# EAGLE design adapter (EAGLE 9.6.2)
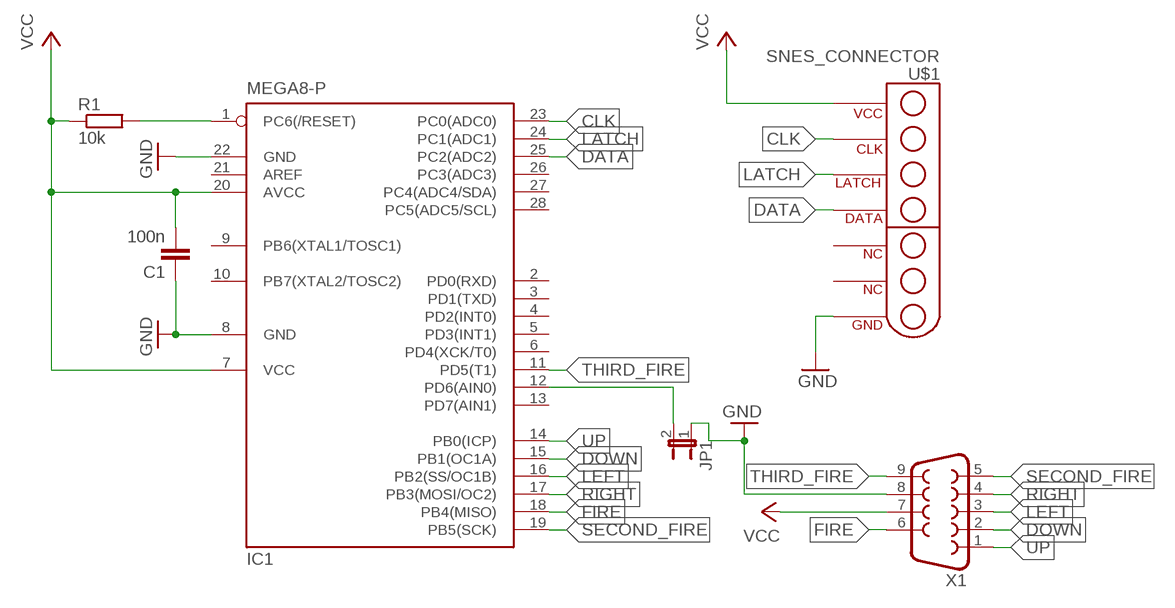
[diagram p0: schematic, sheet 1]

## Parts
C1  100n  C-EU025-025X050  [C025-025X050]
IC1  MEGA8-P  [DIL28-3]
JP1  JP1E  [JP1]
R1  10k  R-EU_0207/10  [0207/10]
U$1  SNES_CONNECTOR  [SNES_CONNECTOR]
X1  F09D  [F09D]

## Nets
CLK: IC1.23(PC0(ADC0)) U$1.P$9(CLK)
DATA: IC1.25(PC2(ADC2)) U$1.P$11(DATA)
DOWN: IC1.15(PB1(OC1A)) X1.2
FIRE: IC1.18(PB4(MISO)) X1.6
GND: C1.1 IC1.8(GND) IC1.22(GND) JP1.1 U$1.P$14(GND) X1.8
LATCH: IC1.24(PC1(ADC1)) U$1.P$10(LATCH)
LEFT: IC1.16(PB2(SS/OC1B)) X1.3
N$1: IC1.12(PD6(AIN0)) JP1.2
N$2: IC1.1(PC6(/RESET)) R1.2
RIGHT: IC1.17(PB3(MOSI/OC2)) X1.4
SECOND_FIRE: IC1.19(PB5(SCK)) X1.5
THIRD_FIRE: IC1.11(PD5(T1)) X1.9
UP: IC1.14(PB0(ICP)) X1.1
VCC [bold]: C1.2 IC1.7(VCC) IC1.20(AVCC) R1.1 U$1.P$8(VCC) X1.7
Unconnected: IC1.2(PD0(RXD)) IC1.3(PD1(TXD)) IC1.4(PD2(INT0)) IC1.5(PD3(INT1)) IC1.6(PD4(XCK/T0)) IC1.9(PB6(XTAL1/TOSC1)) IC1.10(PB7(XTAL2/TOSC2)) IC1.13(PD7(AIN1)) IC1.21(AREF) IC1.26(PC3(ADC3)) IC1.27(PC4(ADC4/SDA)) IC1.28(PC5(ADC5/SCL)) U$1.P$12(NC1) U$1.P$13(NC2)

## Library data of the parts
C1 = rcl:C-EU: CAPACITOR, European symbol; SPICEPREFIX: C
IC1 = atmel:MEGA8-P: MICROCONTROLLER 8 Kbytes FLASH, 1 kbytes SRAM, 512 bytes EEPROM, USART, 4-channel 10 bit ADC, 2-channel 8 bit ADC Pin compatible with Atmega48, ATMega88, ATMega168 Source: avr.lbr; OC_FARNELL: unknown; OC_NEWARK: unknown
JP1 = jumper:JP1E: JUMPER
R1 = rcl:R-EU_: RESISTOR, European symbol; SPICEPREFIX: R
U$1 = uzebox:SNES_CONNECTOR: Generic SNES connector
X1 = con-subd:F09: SUB-D; OC_FARNELL: unknown; OC_NEWARK: unknown

## Net classes
1 bold: width 0.508 mm

## Board
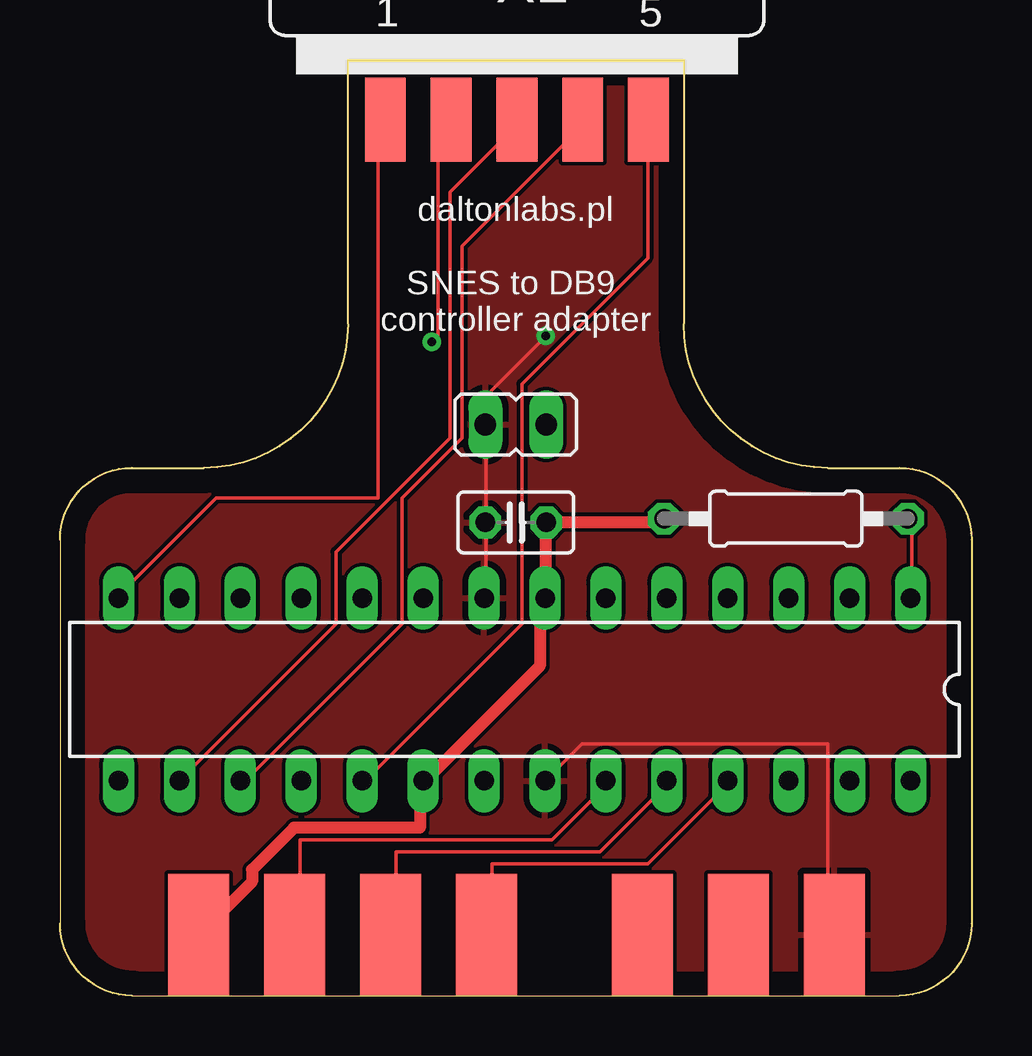
[diagram p1: board, top side]
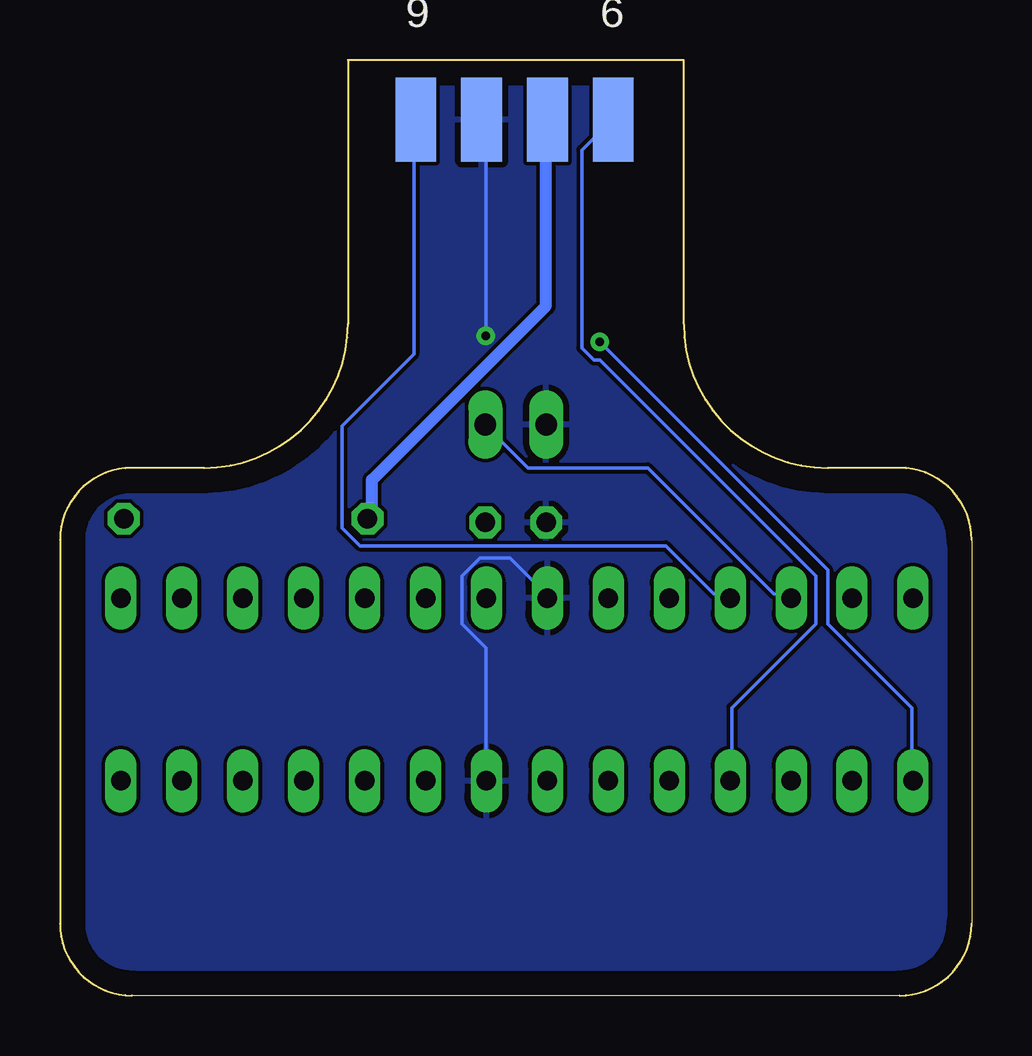
[diagram p2: board, bottom side, seen from below]

Size 38 x 39 mm. Coordinates in mm from the lower left corner, seen from the top.
Outline: 3,0 35,0 arc90 38,3 38,19 arc90 35,22 32,22 arc-90 26,28 26,39 12,39 12,28 arc-90 6,22 3,22 arc90 0,19 0,3 arc90 3,0
Copper layers (1*16): Top 0.035mm / dielectric 1.5mm / Bottom 0.035mm
Design rules "default": minimum track width 6mil, minimum drill 0.35mm, track to track 6mil, track to pad 6mil, pad to pad 6mil, via to via 6mil, smd to smd 6mil, copper to edge 40mil, drill to drill 6mil, minimum pad ring 10mil, minimum via ring 8mil, stop-mask expansion 4mil, vias tented up to drill 0mil, thermal gap 10mil

### Footprints (pad centres in the part's own frame; a part is rotated, then mirrored left to right if it is on the bottom)
C025-025X050 = drill 0.813 octagon: 1 -1.27,0; 2 1.27,0
DIL28-3 = drill 0.813 long: 1 -16.51,-3.81; 2 -13.97,-3.81; 3 -11.43,-3.81; 4 -8.89,-3.81; 5 -6.35,-3.81; 6 -3.81,-3.81; 7 -1.27,-3.81; 8 1.27,-3.81; 9 3.81,-3.81; 10 6.35,-3.81; 11 8.89,-3.81; 12 11.43,-3.81; 13 13.97,-3.81; 14 16.51,-3.81; 15 16.51,3.81; 16 13.97,3.81; 17 11.43,3.81; 18 8.89,3.81; 19 6.35,3.81; 20 3.81,3.81; 21 1.27,3.81; 22 -1.27,3.81; 23 -3.81,3.81; 24 -6.35,3.81; 25 -8.89,3.81; 26 -11.43,3.81; 27 -13.97,3.81; 28 -16.51,3.81
JP1 = drill 0.914 long: 1 0,-1.27; 2 0,1.27
0207/10 = drill 0.813 octagon: 1 -5.08,0; 2 5.08,0
SNES_CONNECTOR = smd 2.54 x 5.08: P$8 -12,2.54; P$9 -8,2.54; P$10 -4,2.54; P$11 0,2.54; P$12 6.5,2.54; P$13 10.5,2.54; P$14 14.5,2.54
F09D = smd 1.7 x 3.5: 1 -5.486,-6.045; 2 -2.743,-6.045; 3 0,-6.045; 4 2.743,-6.045; 5 5.486,-6.045 | smd 1.7 x 3.5 bottom: 6 -4.115,-6.045; 7 -1.372,-6.045; 8 1.372,-6.045; 9 4.115,-6.045

### Placement (x,y rotation side)
C1  19,19.72 0 top
IC1  18.95,12.76 180 top
JP1  19,23.8 270 top
R1  30.26,19.88 0 top
U$1  17.78,0 0 top
X1  19.05,42.56 0 top

### Tracks (layer width: path | path; a pad name or v marks a point on that pad's centre or on a via)
CLK
  Top 0.152: IC1.23 22.75,8.75 20.5,6.5 10,6.5 10,2.75 U$1.P$9
DATA
  Top 0.152: IC1.25 27.75,8.75 24.5,5.5 18,5.5 18,2.75 U$1.P$11
DOWN  (via drill 0.35)
  Top 0.152: v15.5,27.25 15.75,27.5 15.75,36 16.25,36.5 X1.2
  Bottom 0.152: v15.5,27.25 6,17.75 6,15.5 2.5,12 2.5,9 IC1.15
FIRE
  Bottom 0.152: IC1.18 10,9 10,12 6.5,15.5 6.5,17.5 15.5,26.5 15.75,26.5 16.25,27 16.25,35.25 15,36.5 X1.6
GND  (via drill 0.35)
  Top 0.152: IC1.22 20.25,9 21.75,10.5 32,10.5 32,3 32.25,2.75 U$1.P$14 | IC1.8 17.75,16.75 17.75,19.5 C1.1 17.75,19.75 17.75,23.75 JP1.1 17.75,24 17.75,25 v20.25,27.5
  Bottom 0.152: v20.25,27.5 20.25,36.5 X1.8 | IC1.22 20.25,9 20.25,14.5 21.25,15.5 21.25,17.5 20.5,18.25 19.25,18.25 17.75,16.75 IC1.8
  pour Top: -1,40 41,40 41,-1 -1,-1
  pour Bottom: 0,40 42,40 42,-1 -3,-1 -3,40
LATCH
  Top 0.152: IC1.24 25.25,8.75 22.5,6 14,6 14,2.75 U$1.P$10
LEFT
  Top 0.152: IC1.16 5,9 11.5,15.5 11.5,18.5 16.25,23.25 16.25,33.5 19,36.25 19,36.5 X1.3
N$1
  Bottom 0.152: IC1.12 7.75,16.75 8.25,16.75 13.5,22 18.5,22 20.25,23.75 JP1.2
N$2
  Top 0.152: IC1.1 35.5,16.75 35.5,19.75 R1.2
RIGHT
  Top 0.152: IC1.17 7.75,9 14.25,15.5 14.25,20.75 16.75,23.25 16.75,31.25 21.75,36.25 21.75,36.5 X1.4
SECOND_FIRE
  Top 0.152: IC1.19 12.75,9 19.25,15.5 19.25,25.5 24.5,30.75 24.5,36.5 X1.5
THIRD_FIRE
  Bottom 0.152: IC1.11 10.25,16.75 10.75,16.75 12.75,18.75 25.5,18.75 26.25,19.5 26.25,23.75 23.25,26.75 23.25,36.5 X1.9
UP
  Top 0.152: IC1.14 2.5,16.75 6.5,20.75 13.25,20.75 13.25,36.25 13.5,36.5 X1.1
VCC
  Top 0.508: R1.1 25,19.75 20.5,19.75 C1.2 20.25,19.5 20.25,16.75 IC1.7 20,16.5 20,13.75 15.25,9 IC1.20 15,8.75 15,7 9.75,7 8,5.25 8,4.75 6,2.75 U$1.P$8
  Bottom 0.508: X1.7 17.75,36.5 17.75,28.75 25,21.5 25,20 R1.1

### Text on the board
tNames: daltonlabs.pl / / SNES to DB9 / controller adapter